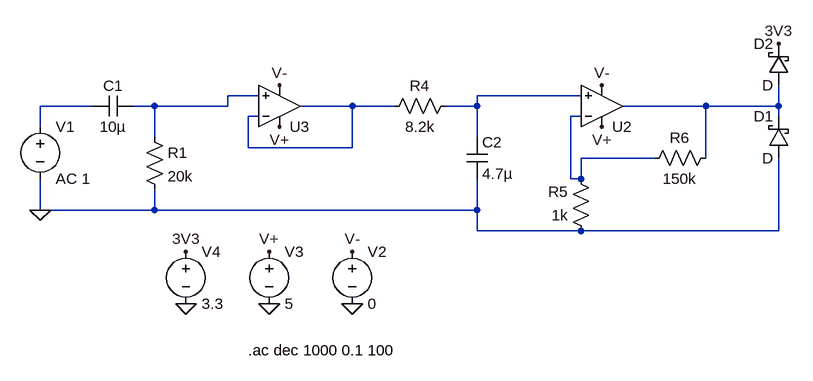
[diagram p0: schematic heartbeatFilter.asc]
heartbeatFilter.asc, the LTspice schematic file:
Version 4
SHEET 1 1336 680
WIRE 464 80 416 80
WIRE 960 80 800 80
WIRE 208 96 128 96
WIRE 304 96 272 96
WIRE 416 96 416 80
WIRE 416 96 304 96
WIRE 608 96 528 96
WIRE 672 96 608 96
WIRE 800 96 800 80
WIRE 800 96 752 96
WIRE 1152 96 1024 96
WIRE 1264 96 1264 64
WIRE 1264 96 1152 96
WIRE 464 112 448 112
WIRE 960 112 944 112
WIRE 1264 112 1264 96
WIRE 128 128 128 96
WIRE 304 144 304 96
WIRE 800 144 800 96
WIRE 448 160 448 112
WIRE 608 160 608 96
WIRE 608 160 448 160
WIRE 1072 176 960 176
WIRE 1152 176 1152 96
WIRE 944 208 944 112
WIRE 960 208 960 176
WIRE 960 208 944 208
WIRE 128 256 128 208
WIRE 304 256 304 224
WIRE 304 256 128 256
WIRE 800 256 800 208
WIRE 800 256 304 256
WIRE 800 288 800 256
WIRE 960 288 800 288
WIRE 1264 288 1264 176
WIRE 1264 288 960 288
FLAG 128 256 0
FLAG 608 400 0
FLAG 480 400 0
FLAG 480 320 V+
FLAG 608 320 V-
FLAG 992 64 V-
FLAG 992 128 V+
FLAG 496 128 V+
FLAG 496 64 V-
FLAG 352 400 0
FLAG 352 320 3V3
FLAG 1264 0 3V3
SYMBOL voltage 128 112 R0
SYMATTR InstName V1
SYMATTR Value AC 1
SYMBOL cap 272 80 R90
WINDOW 0 0 32 VBottom 2
WINDOW 3 32 32 VTop 2
SYMATTR InstName C1
SYMATTR Value 10µ
SYMBOL res 288 128 R0
SYMATTR InstName R1
SYMATTR Value 20k
SYMBOL cap 784 144 R0
SYMATTR InstName C2
SYMATTR Value 4.7µ
SYMBOL res 768 80 R90
WINDOW 0 0 56 VBottom 2
WINDOW 3 32 56 VTop 2
SYMATTR InstName R4
SYMATTR Value 8.2k
SYMBOL voltage 608 304 R0
WINDOW 123 0 0 Left 0
WINDOW 39 0 0 Left 0
SYMATTR InstName V2
SYMATTR Value 0
SYMBOL voltage 480 304 R0
WINDOW 123 0 0 Left 0
WINDOW 39 0 0 Left 0
SYMATTR InstName V3
SYMATTR Value 5
SYMBOL OpAmps\\UniversalOpAmp 992 96 M180
SYMATTR InstName U2
SYMBOL res 976 304 R180
WINDOW 0 36 76 Left 2
WINDOW 3 36 40 Left 2
SYMATTR InstName R5
SYMATTR Value 1k
SYMBOL res 1168 160 R90
WINDOW 0 0 56 VBottom 2
WINDOW 3 32 56 VTop 2
SYMATTR InstName R6
SYMATTR Value 150k
SYMBOL OpAmps\\UniversalOpAmp 496 96 M180
SYMATTR InstName U3
SYMBOL schottky 1280 176 R180
WINDOW 0 24 64 Left 2
WINDOW 3 24 0 Left 2
SYMATTR InstName D1
SYMBOL schottky 1280 64 R180
WINDOW 0 24 64 Left 2
WINDOW 3 24 0 Left 2
SYMATTR InstName D2
SYMBOL voltage 352 304 R0
WINDOW 123 0 0 Left 0
WINDOW 39 0 0 Left 0
SYMATTR InstName V4
SYMATTR Value 3.3
TEXT 448 472 Left 2 !.ac dec 1000 0.1 100

The netlist it stands for:
* heartbeatFilter.asc
V1 N003 0 AC 1
C1 N001 N003 10µ
R1 N001 0 20k
C2 N002 0 4.7µ
R4 N002 N004 8.2k
V2 V- 0 0
V3 V+ 0 5
XU2 N002 N006 V+ V- N005 level1 Avol=1Meg GBW=10Meg Vos=0 En=0 Enk=0 In=0 Ink=0 Rin=500Meg  ; pins In+ In- V+ V- OUT
R5 0 N006 1k
R6 N005 N006 150k
XU3 N001 N004 V+ V- N004 level1 Avol=1Meg GBW=10Meg Vos=0 En=0 Enk=0 In=0 Ink=0 Rin=500Meg  ; pins In+ In- V+ V- OUT
D1 0 N005 D
D2 N005 3V3 D
V4 3V3 0 3.3
.model D D
.lib standard.dio
.ac dec 1000 0.1 100
.lib UniversalOpAmp1.lib
.backanno
.end